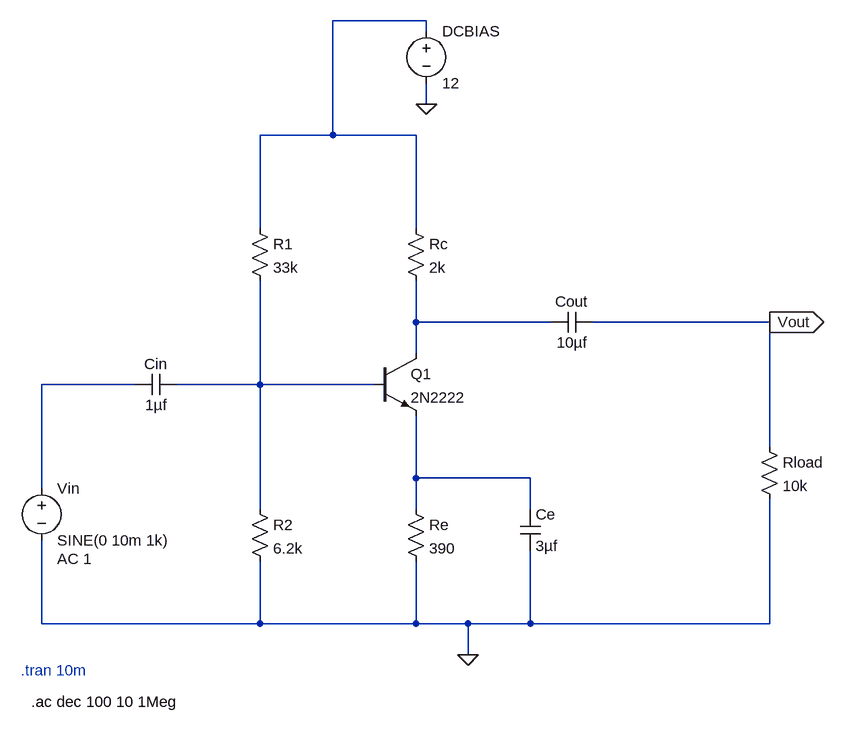
[diagram p0: schematic Day1_CE_Amp.asc]
Day1_CE_Amp.asc, the LTspice schematic file:
Version 4.1
SHEET 1 880 800
WIRE 192 -384 48 -384
WIRE 192 -368 192 -384
WIRE 192 -256 192 -288
WIRE 48 -208 48 -384
WIRE 48 -208 -64 -208
WIRE 176 -208 48 -208
WIRE -64 -64 -64 -208
WIRE 176 -64 176 -208
WIRE 176 80 176 16
WIRE 384 80 176 80
WIRE 720 80 448 80
WIRE 176 128 176 80
WIRE -256 176 -400 176
WIRE -64 176 -64 16
WIRE -64 176 -192 176
WIRE 112 176 -64 176
WIRE 720 272 720 80
WIRE 176 320 176 224
WIRE 352 320 176 320
WIRE -400 336 -400 176
WIRE -64 368 -64 176
WIRE 176 368 176 320
WIRE 352 368 352 320
WIRE -400 544 -400 416
WIRE -64 544 -64 448
WIRE -64 544 -400 544
WIRE 176 544 176 448
WIRE 176 544 -64 544
WIRE 256 544 176 544
WIRE 352 544 352 432
WIRE 352 544 256 544
WIRE 720 544 720 352
WIRE 720 544 352 544
WIRE 256 592 256 544
FLAG 256 592 0
FLAG 192 -256 0
FLAG 720 80 Vout
IOPIN 720 80 Out
SYMBOL npn 112 128 R0
SYMATTR InstName Q1
SYMATTR Value 2N2222
SYMBOL res -80 -80 R0
SYMATTR InstName R1
SYMATTR Value 33k
SYMBOL res 160 352 R0
SYMATTR InstName Re
SYMATTR Value 390
SYMBOL res 160 -80 R0
SYMATTR InstName Rc
SYMATTR Value 2k
SYMBOL res -80 352 R0
SYMATTR InstName R2
SYMATTR Value 6.2k
SYMBOL cap -192 160 R90
WINDOW 0 0 32 VBottom 2
WINDOW 3 32 32 VTop 2
SYMATTR InstName Cin
SYMATTR Value 1µf
SYMBOL voltage -400 320 R0
WINDOW 123 24 124 Left 2
WINDOW 39 0 0 Left 0
SYMATTR Value2 AC 1
SYMATTR InstName Vin
SYMATTR Value SINE(0 10m 1k)
SYMBOL cap 336 368 R0
SYMATTR InstName Ce
SYMATTR Value 3µf
SYMBOL cap 448 64 R90
WINDOW 0 0 32 VBottom 2
WINDOW 3 32 32 VTop 2
SYMATTR InstName Cout
SYMATTR Value 10µf
SYMBOL voltage 192 -384 R0
WINDOW 123 0 0 Left 0
WINDOW 39 0 0 Left 0
SYMATTR InstName DCBIAS
SYMATTR Value 12
SYMBOL res 704 256 R0
SYMATTR InstName Rload
SYMATTR Value 10k
TEXT -432 616 Left 2 ;.tran 10m
TEXT -416 664 Left 2 !.ac dec 100 10 1Meg

The netlist it stands for:
* Day1_CE_Amp.asc
Q1 N002 N004 N005 0 2N2222
R1 N001 N004 33k
Re N005 0 390
Rc N001 N002 2k
R2 N004 0 6.2k
Cin N004 N003 1µf
Vin N003 0 SINE(0 10m 1k) AC 1
Ce N005 0 3µf
Cout Vout N002 10µf
V§DCBIAS N001 0 12
Rload Vout 0 10k
.model NPN NPN
.model PNP PNP
.lib standard.bjt
* .tran 10m
.ac dec 100 10 1Meg
.backanno
.end